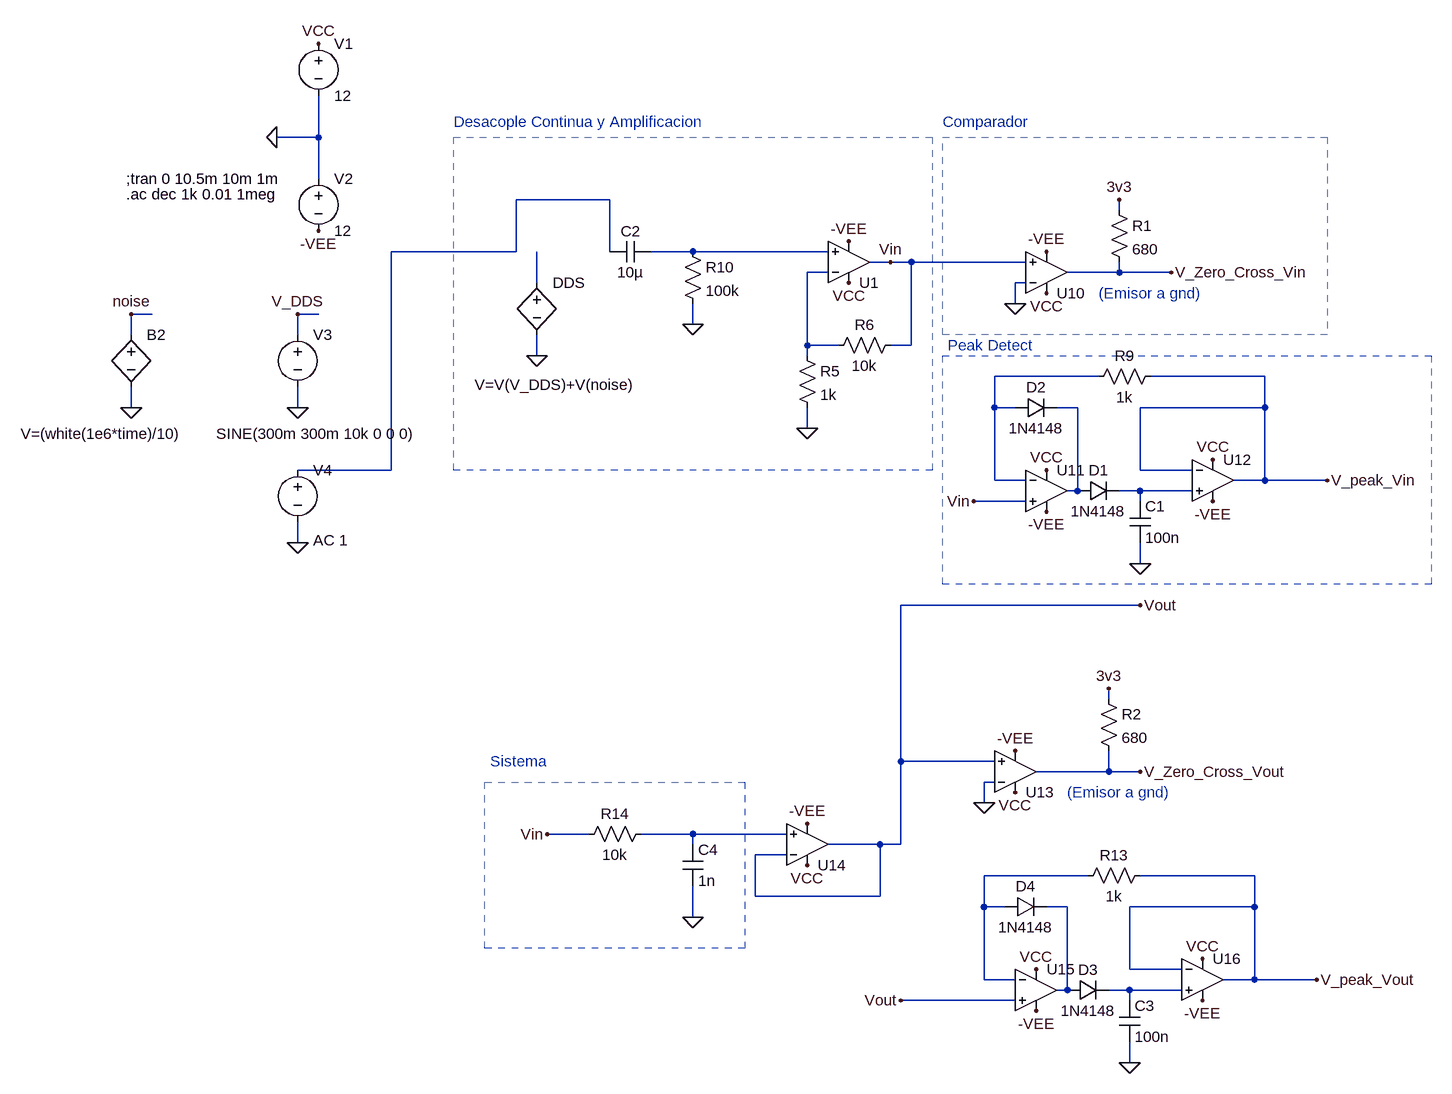
[diagram p0: schematic Bode_Analyzer.asc]
Bode_Analyzer.asc, the LTspice schematic file:
Version 4
SHEET 1 1480 1380
WIRE -352 -64 -352 -128
WIRE -352 -64 -416 -64
WIRE -352 0 -352 -64
WIRE 96 32 -48 32
WIRE 880 48 880 32
WIRE -48 112 -48 32
WIRE -48 112 -240 112
WIRE 96 112 96 32
WIRE 224 112 160 112
WIRE 432 112 224 112
WIRE 528 128 496 128
WIRE 560 128 528 128
WIRE 736 128 560 128
WIRE 432 144 400 144
WIRE 880 144 880 128
WIRE 880 144 800 144
WIRE 960 144 880 144
WIRE -16 160 -16 112
WIRE 736 160 720 160
WIRE 720 192 720 160
WIRE -608 208 -640 208
WIRE -352 208 -384 208
WIRE 224 224 224 192
WIRE -640 240 -640 208
WIRE -384 240 -384 208
WIRE 400 256 400 144
WIRE 448 256 400 256
WIRE 560 256 560 128
WIRE 560 256 528 256
WIRE -16 272 -16 240
WIRE 400 272 400 256
WIRE 848 304 688 304
WIRE 1104 304 928 304
WIRE -640 352 -640 320
WIRE -384 352 -384 320
WIRE 688 352 688 304
WIRE 720 352 688 352
WIRE 816 352 784 352
WIRE 1104 352 1104 304
WIRE 1104 352 912 352
WIRE 400 384 400 352
WIRE -240 448 -240 112
WIRE -240 448 -384 448
WIRE 912 448 912 352
WIRE 992 448 912 448
WIRE 688 464 688 352
WIRE 736 464 688 464
WIRE 1104 464 1104 352
WIRE 1104 464 1056 464
WIRE 1200 464 1104 464
WIRE 816 480 816 352
WIRE 816 480 800 480
WIRE 912 480 880 480
WIRE 992 480 912 480
WIRE 736 496 656 496
WIRE 912 496 912 480
WIRE -384 560 -384 528
WIRE 912 592 912 560
WIRE 912 656 544 656
WIRE 864 800 864 784
WIRE 544 896 544 656
WIRE 688 896 544 896
WIRE 864 912 864 880
WIRE 864 912 752 912
WIRE 912 912 864 912
WIRE 688 928 672 928
WIRE 672 960 672 928
WIRE 64 1008 0 1008
WIRE 224 1008 144 1008
WIRE 368 1008 224 1008
WIRE 224 1024 224 1008
WIRE 512 1024 432 1024
WIRE 544 1024 544 896
WIRE 544 1024 512 1024
WIRE 368 1040 320 1040
WIRE 832 1072 672 1072
WIRE 1088 1072 912 1072
WIRE 320 1104 320 1040
WIRE 512 1104 512 1024
WIRE 512 1104 320 1104
WIRE 672 1120 672 1072
WIRE 704 1120 672 1120
WIRE 800 1120 768 1120
WIRE 1088 1120 1088 1072
WIRE 1088 1120 896 1120
WIRE 224 1136 224 1088
WIRE 896 1216 896 1120
WIRE 976 1216 896 1216
WIRE 672 1232 672 1120
WIRE 720 1232 672 1232
WIRE 1088 1232 1088 1120
WIRE 1088 1232 1040 1232
WIRE 1184 1232 1088 1232
WIRE 800 1248 800 1120
WIRE 800 1248 784 1248
WIRE 896 1248 864 1248
WIRE 976 1248 896 1248
WIRE 720 1264 544 1264
WIRE 896 1264 896 1248
WIRE 896 1360 896 1328
FLAG -416 -64 0
FLAG -352 -208 VCC
FLAG -352 80 -VEE
FLAG -384 352 0
FLAG 400 384 0
FLAG 464 160 VCC
FLAG 464 96 -VEE
FLAG 768 176 VCC
FLAG -16 272 0
FLAG -384 208 V_DDS
FLAG -640 352 0
FLAG -640 208 noise
FLAG 912 592 0
FLAG 1024 432 VCC
FLAG 1024 496 -VEE
FLAG 768 448 VCC
FLAG 768 512 -VEE
FLAG 720 192 0
FLAG 528 128 Vin
FLAG 960 144 V_Zero_Cross_Vin
FLAG 1200 464 V_peak_Vin
FLAG -384 560 0
FLAG 224 224 0
FLAG 656 496 Vin
FLAG 720 880 -VEE
FLAG 720 944 VCC
FLAG 896 1360 0
FLAG 1008 1200 VCC
FLAG 1008 1264 -VEE
FLAG 752 1216 VCC
FLAG 752 1280 -VEE
FLAG 672 960 0
FLAG 912 656 Vout
FLAG 912 912 V_Zero_Cross_Vout
FLAG 1184 1232 V_peak_Vout
FLAG 544 1264 Vout
FLAG 224 1136 0
FLAG 400 992 -VEE
FLAG 400 1056 VCC
FLAG 0 1008 Vin
FLAG 768 112 -VEE
FLAG 880 32 3v3
FLAG 864 784 3v3
SYMBOL voltage -352 -224 R0
WINDOW 123 0 0 Left 0
WINDOW 39 0 0 Left 0
SYMATTR InstName V1
SYMATTR Value 12
SYMBOL voltage -352 -16 R0
WINDOW 123 0 0 Left 0
WINDOW 39 0 0 Left 0
SYMATTR InstName V2
SYMATTR Value 12
SYMBOL voltage -384 224 R0
WINDOW 3 -125 168 Left 2
WINDOW 123 0 0 Left 0
WINDOW 39 0 0 Left 0
SYMATTR Value SINE(300m 300m 10k 0 0 0)
SYMATTR InstName V3
SYMBOL res 384 256 R0
SYMATTR InstName R5
SYMATTR Value 1k
SYMBOL res 544 240 R90
WINDOW 0 0 56 VBottom 2
WINDOW 3 32 56 VTop 2
SYMATTR InstName R6
SYMATTR Value 10k
SYMBOL bv -16 144 R0
WINDOW 3 -96 173 Left 2
SYMATTR Value V=V(V_DDS)+V(noise)
SYMATTR InstName DDS
SYMBOL bv -640 224 R0
WINDOW 3 -170 168 Left 2
SYMATTR Value V=(white(1e6*time)/10)
SYMATTR InstName B2
SYMBOL cap 896 496 R0
SYMATTR InstName C1
SYMATTR Value 100n
SYMBOL res 944 288 R90
WINDOW 0 0 56 VBottom 2
WINDOW 3 32 56 VTop 2
SYMATTR InstName R9
SYMATTR Value 1k
SYMBOL diode 816 496 R270
WINDOW 0 32 32 VTop 2
WINDOW 3 0 32 VBottom 2
SYMATTR InstName D1
SYMATTR Value 1N4148
SYMATTR Description Schottky diode
SYMATTR Type schottky
SYMBOL diode 720 368 R270
WINDOW 0 32 32 VTop 2
WINDOW 3 0 32 VBottom 2
SYMATTR InstName D2
SYMATTR Value 1N4148
SYMATTR Description Schottky diode
SYMATTR Type schottky
SYMBOL cap 160 96 R90
WINDOW 0 0 32 VBottom 2
WINDOW 3 32 32 VTop 2
SYMATTR InstName C2
SYMATTR Value 10µ
SYMBOL voltage -384 432 R0
WINDOW 123 24 124 Left 2
WINDOW 39 0 0 Left 0
SYMATTR Value2 AC 1
SYMATTR InstName V4
SYMATTR Value ""
SYMBOL res 208 96 R0
SYMATTR InstName R10
SYMATTR Value 100k
SYMBOL cap 880 1264 R0
SYMATTR InstName C3
SYMATTR Value 100n
SYMBOL res 928 1056 R90
WINDOW 0 0 56 VBottom 2
WINDOW 3 32 56 VTop 2
SYMATTR InstName R13
SYMATTR Value 1k
SYMBOL diode 800 1264 R270
WINDOW 0 32 32 VTop 2
WINDOW 3 0 32 VBottom 2
SYMATTR InstName D3
SYMATTR Value 1N4148
SYMATTR Description Schottky diode
SYMATTR Type schottky
SYMBOL diode 704 1136 R270
WINDOW 0 32 32 VTop 2
WINDOW 3 0 32 VBottom 2
SYMATTR InstName D4
SYMATTR Value 1N4148
SYMATTR Description Schottky diode
SYMATTR Type schottky
SYMBOL res 160 992 R90
WINDOW 0 0 56 VBottom 2
WINDOW 3 32 56 VTop 2
SYMATTR InstName R14
SYMATTR Value 10k
SYMBOL cap 208 1024 R0
SYMATTR InstName C4
SYMATTR Value 1n
SYMBOL OpAmps\\UniversalOpamp2 464 128 M180
SYMATTR InstName U1
SYMBOL OpAmps\\UniversalOpamp2 768 144 M180
SYMATTR InstName U10
SYMBOL OpAmps\\UniversalOpamp2 768 480 R0
SYMATTR InstName U11
SYMBOL OpAmps\\UniversalOpamp2 1024 464 R0
SYMATTR InstName U12
SYMBOL OpAmps\\UniversalOpamp2 720 912 M180
SYMATTR InstName U13
SYMBOL OpAmps\\UniversalOpamp2 400 1024 M180
SYMATTR InstName U14
SYMBOL OpAmps\\UniversalOpamp2 752 1248 R0
SYMATTR InstName U15
SYMBOL OpAmps\\UniversalOpamp2 1008 1232 R0
SYMATTR InstName U16
SYMBOL res 864 32 R0
SYMATTR InstName R1
SYMATTR Value 680
SYMBOL res 848 784 R0
SYMATTR InstName R2
SYMATTR Value 680
TEXT -648 0 Left 2 !;tran 0 10.5m 10m 1m
TEXT -648 24 Left 2 !.ac dec 1k 0.01 1meg
TEXT -144 -88 Left 2 ;Desacople Continua y Amplificacion
TEXT -88 896 Left 2 ;Sistema
TEXT 608 -88 Left 2 ;Comparador
TEXT 616 256 Left 2 ;Peak Detect
TEXT 800 944 Left 2 ;(Emisor a gnd)
TEXT 848 176 Left 2 ;(Emisor a gnd)
RECTANGLE Normal 592 448 -144 -64 2
RECTANGLE Normal 1200 240 608 -64 2
RECTANGLE Normal 1360 624 608 272 2
RECTANGLE Normal 304 1184 -96 928 2

The netlist it stands for:
* Bode_Analyzer.asc
V1 VCC 0 12
V2 0 -VEE 12
V3 V_DDS 0 SINE(300m 300m 10k 0 0 0)
R5 N003 0 1k
R6 Vin N003 10k
B§DDS N004 0 V=V(V_DDS)+V(noise)
B2 noise 0 V=(white(1e6*time)/10)
C1 N007 0 100n
R9 V_peak_Vin N005 1k
D1 N006 N007 1N4148
D2 N005 N006 1N4148
C2 N002 N001 10µ
V4 N001 0 AC 1
R10 N002 0 100k
C3 N011 0 100n
R13 V_peak_Vout N009 1k
D3 N010 N011 1N4148
D4 N009 N010 1N4148
R14 N008 Vin 10k
C4 N008 0 1n
XU1 N002 N003 VCC -VEE Vin level.2 Avol=1Meg GBW=10Meg Slew=10Meg ilimit=25m rail=0 Vos=0 phimargin=45 en=0 enk=0 in=0 ink=0 Rin=500Meg  ; pins IN+ IN- V+ V- OUT
XU10 Vin 0 VCC -VEE V_Zero_Cross_Vin level.2 Avol=1Meg GBW=10Meg Slew=10Meg ilimit=25m rail=0 Vos=0 phimargin=45 en=0 enk=0 in=0 ink=0 Rin=500Meg  ; pins IN+ IN- V+ V- OUT
XU11 Vin N005 VCC -VEE N006 level.2 Avol=1Meg GBW=10Meg Slew=10Meg ilimit=25m rail=0 Vos=0 phimargin=45 en=0 enk=0 in=0 ink=0 Rin=500Meg  ; pins IN+ IN- V+ V- OUT
XU12 N007 V_peak_Vin VCC -VEE V_peak_Vin level.2 Avol=1Meg GBW=10Meg Slew=10Meg ilimit=25m rail=0 Vos=0 phimargin=45 en=0 enk=0 in=0 ink=0 Rin=500Meg  ; pins IN+ IN- V+ V- OUT
XU13 Vout 0 VCC -VEE V_Zero_Cross_Vout level.2 Avol=1Meg GBW=10Meg Slew=10Meg ilimit=25m rail=0 Vos=0 phimargin=45 en=0 enk=0 in=0 ink=0 Rin=500Meg  ; pins IN+ IN- V+ V- OUT
XU14 N008 Vout VCC -VEE Vout level.2 Avol=1Meg GBW=10Meg Slew=10Meg ilimit=25m rail=0 Vos=0 phimargin=45 en=0 enk=0 in=0 ink=0 Rin=500Meg  ; pins IN+ IN- V+ V- OUT
XU15 Vout N009 VCC -VEE N010 level.2 Avol=1Meg GBW=10Meg Slew=10Meg ilimit=25m rail=0 Vos=0 phimargin=45 en=0 enk=0 in=0 ink=0 Rin=500Meg  ; pins IN+ IN- V+ V- OUT
XU16 N011 V_peak_Vout VCC -VEE V_peak_Vout level.2 Avol=1Meg GBW=10Meg Slew=10Meg ilimit=25m rail=0 Vos=0 phimargin=45 en=0 enk=0 in=0 ink=0 Rin=500Meg  ; pins IN+ IN- V+ V- OUT
R1 3v3 V_Zero_Cross_Vin 680
R2 3v3 V_Zero_Cross_Vout 680
.model D D
.lib standard.dio
;tran 0 10.5m 10m 1m
.ac dec 1k 0.01 1meg
* Desacople Continua y Amplificacion
* Sistema
* Comparador
* Peak Detect
* (Emisor a gnd)
* (Emisor a gnd)
.lib UniversalOpamps2.sub
.backanno
.end